# Altium schematic sheet Battery_Charger.SchDoc
size A4; SheetNumber: 2; SheetTotal: 3
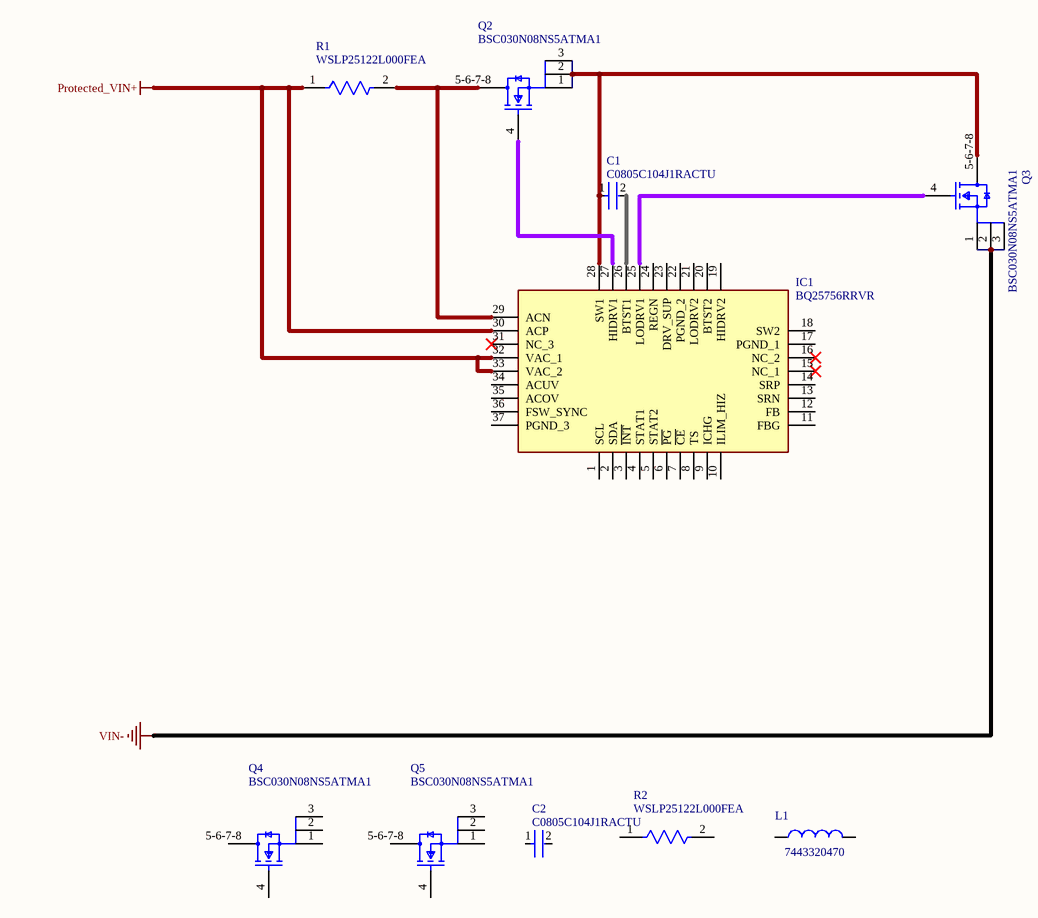
[diagram p0: Battery_Charger.SchDoc]

## Parts
C1  C0805C104J1RACTU  [FP-C0805C-DN-MFG]
C2  C0805C104J1RACTU  [FP-C0805C-DN-MFG]
IC1  BQ25756RRVR  [QFN50P500X600X100-37N-D]
L1  7443320470  [WE-HCC_1210]
Q2  BSC030N08NS5ATMA1  [FP-PG-TDSON-8-MFG]
Q3  BSC030N08NS5ATMA1  [FP-PG-TDSON-8-MFG]
Q4  BSC030N08NS5ATMA1  [FP-PG-TDSON-8-MFG]
Q5  BSC030N08NS5ATMA1  [FP-PG-TDSON-8-MFG]
R1  WSLP25122L000FEA  [FP-WSLP2512-0R001-0R0049-MFG]
R2  WSLP25122L000FEA  [FP-WSLP2512-0R001-0R0049-MFG]

## Nets
Protected_VIN+: IC1.30(ACP) IC1.32(VAC_1) IC1.33(VAC_2) R1.1
VIN-: Q3.1(S) Q3.2(S) Q3.3(S)
NetC1_1: C1.1 IC1.28(SW1) Q2.1(S) Q2.2(S) Q2.3(S) Q3.5-6-7-8(D)
NetC1_2: C1.2 IC1.26(BTST1)
NetIC1_25: IC1.25(LODRV1) Q3.4(G)
NetIC1_27: IC1.27(HIDRV1) Q2.4(G)
NetIC1_29: IC1.29(ACN) Q2.5-6-7-8(D) R1.2

Not connected (* = marked no-connect by the designer): C2 1 2; IC1 1(SCL) 2(SDA) 3(~{INT}) 4(STAT1) 5(STAT2) 6(~{PG}) 7(~{CE}) 8(TS) 9(ICHG) 10(ILIM_HIZ) 11(FBG) 12(FB) 13(SRN) 14(SRP) 15(NC_1)* 16(NC_2)* 17(PGND_1) 18(SW2) 19(HIDRV2) 20(BTST2) 21(LODRV2) 22(PGND_2) 23(DRV_SUP) 24(REGN) 31(NC_3)* 34(ACUV) 35(ACOV) 36(FSW_SYNC) 37(PGND_3); L1 1 2; Q4 1(S) 2(S) 3(S) 4(G) 5-6-7-8(D); Q5 1(S) 2(S) 3(S) 4(G) 5-6-7-8(D); R2 1 2

## Library data of the parts
C1 C2 = CMP-1036-04426-3: CAP CER 0.1UF 100V 5% X7R 0805; Manufacturer: KEMET; Capacitance: 0.10 μF; Temperature Coefficient: 30ppm/°C; Value: 0.10 μF; Tolerance: 0.05; Description: C0805 0.10 μF X7R 30ppm/°C 5.00% 100 V; Material: Ceramic; Digikey Description: CAP CER 0.1UF 100V 5% X7R 0805; RoHS: TRUE; Octopart: https://octopart.com/c0805c104j1ractu-kemet-10469001; Automotive: No; Mouser Description: Multilayer Ceramic Capacitors MLCC - SMD/SMT 100V 0.1uF 5% X7R; Device Class L3: Ceramic Capacitors; Temperature: -55°C to +125°C; Temperature Range High: +125°C; ComponentLink2Description: Datasheet; Manufacturer Part Number: C0805C104J1RACTU; ComponentLink2URL: https://content.kemet.com/datasheets/KEM_C1003_C0G_SMD.pdf; Device Class L2: Capacitors; Device Class L1: Passive Components; Category: Cap; Temperature Characteristic: X7R; Voltage Rating: 100 V; Temperature Range Low: -55°C; Package: C0805C-DN; Height: 0.88mm; Ipc Land Pattern Name: CAPC200125X78; Lead Free: Yes
IC1 = BQ25756RRVR: Integrated Circuit; Manufacturer_Name: Texas Instruments; Datasheet Link: https://www.ti.com.cn/cn/lit/ds/symlink/bq25756.pdf?ts=1699839190732&ref_url=https%253A%252F%252Fwww.ti.com.cn%252Fproduct%252Fcn%252FBQ25756; Height: 1mm; Manufacturer_Part_Number: BQ25756RRVR; Mouser Part Number: 595-BQ25756RRVR; Mouser Price/Stock: https://www.mouser.co.uk/ProductDetail/Texas-Instruments/BQ25756RRVR?qs=HoCaDK9Nz5ckDWwb4xOATA%3D%3D; Arrow Part Number: BQ25756RRVR; Arrow Price/Stock: https://www.arrow.com/en/products/bq25756rrvr/texas-instruments.html?utm_currency=USD&region=nac; Supplier 1: Mouser; Supplier Part Number 1: 595-BQ25756RRVR
L1 = CMP-0226-00121-3: We-hcc Series, Shielded Wire-wound SMD Inductor With Ferrite Core, 4.7 Uh; Inductance Tolerance: 20%; Self Resonant Frequency: 43MHz; Saturation Current: 15.6A; Current Rating: 15.5A; Inductance: 4.7µH; DC Resistance (DCR): 7.25mΩ; Width: 11.4mm; Core Material: Ferrite; Number of Pins: 2; Material: Ferrite; RoHS: Compliant; Length: 12.1mm; Max Operating Temperature: 125°C; Ambient Temperature Range Low: -40°C; Min Operating Temperature: -40°C; Height: 9.5mm; Ambient Temperature Range High: 75°C
Q2-Q5 = CMP-32901-000135-1: MOSFET N-CH 80V 100A 8TDSON; Manufacturer: Infineon; Typ Forward Diode Voltage: 0.9V; Drain To Source Resistance: 2.6mΩ; Number Of Channels: 1; Input Capacitace At Vds: 4300pF @ 40V; Transconductance: 110S; Pulse Drain Current: 400A; Reverse Recovery Time: 54ns; Gate To Source Voltage: 20V; Power Dissipation: 2.5W; Threshold Vgs Max: 3.8V; Rthja Max: 50K/W; Turn On Delay Time: 20ns; Reverse Recovery Charge: 94nC; Continuous Drain Current: 22A; Max Junction Temp: +150°C; Gate Charge At Vgs: 61nC @ 10V; Turn Off Delay Time: 43ns; Max Forward Diode Voltage: 1.1V; Depletion Mode: False; Threshold Vgs Min: 2.2V; Footprint Url: https://www.infineon.com/cms/en/product/packages/PG-TDSON/PG-TDSON-8-7/; Device Class L3: MOSFETs; Number Of N Channels: 1; Height: 1.1mm; Digikey Description: MOSFET N-CH 80V 100A 8TDSON; Octopart: https://octopart.com/bsc030n08ns5atma1-infineon-52825708; ComponentLink2URL: https://www.infineon.com/dgdl/Infineon-BSC030N08NS5-DS-v02_02-EN.pdf?fileId=5546d4624ad04ef9014aed52f4210acf; Category: Trans; Drain To Source Voltage: 80V; Package: PG-TDSON-8; Drain To Source Breakdown Voltage: 80V; Mouser Description: BSC030N08NS5ATMA1 N-Channel MOSFET, 100 A, 80 V BSC030N08NS5, 8-Pin TDSON Infineon; ComponentLink2Description: Datasheet; Device Class L1: Discrete Semiconductors; Device Class L2: Transistors; Automotive: No; Manufacturer Part Number: BSC030N08NS5ATMA1; RoHS: TRUE; Temperature Range Low: -55°C; Temperature: -55°C to +150°C; Lead Free: Yes; Temperature Range High: +150°C
R1 R2 = CMP-02407-010958-1: RES 0.002 OHM 1% 3W 2512; Resistance: 2MR; Temperature Coefficient: 275ppm/°C; Size Code: 2512; Width: 3.2mm; Resistor Type: Metal Strip; Packaging: Tape and Reel; Weight: 0.001429oz; RoHS Compliant: Yes; Case Code (Metric): 6432; Case/Package: 2512; Tolerance: 1%; Length: 6.4mm; Case Code (Imperial): 2512; Power Rating: 3W; Min Operating Temperature: -65°C; Mount: Surface Mount; Max Operating Temperature: 170°C; Package Quantity: 2000; Series: WSLP; Height: 0.635mm; Termination: SMD/SMT; Lead Free: Lead Free